# EAGLE design LT5560 (EAGLE 9.3.1)
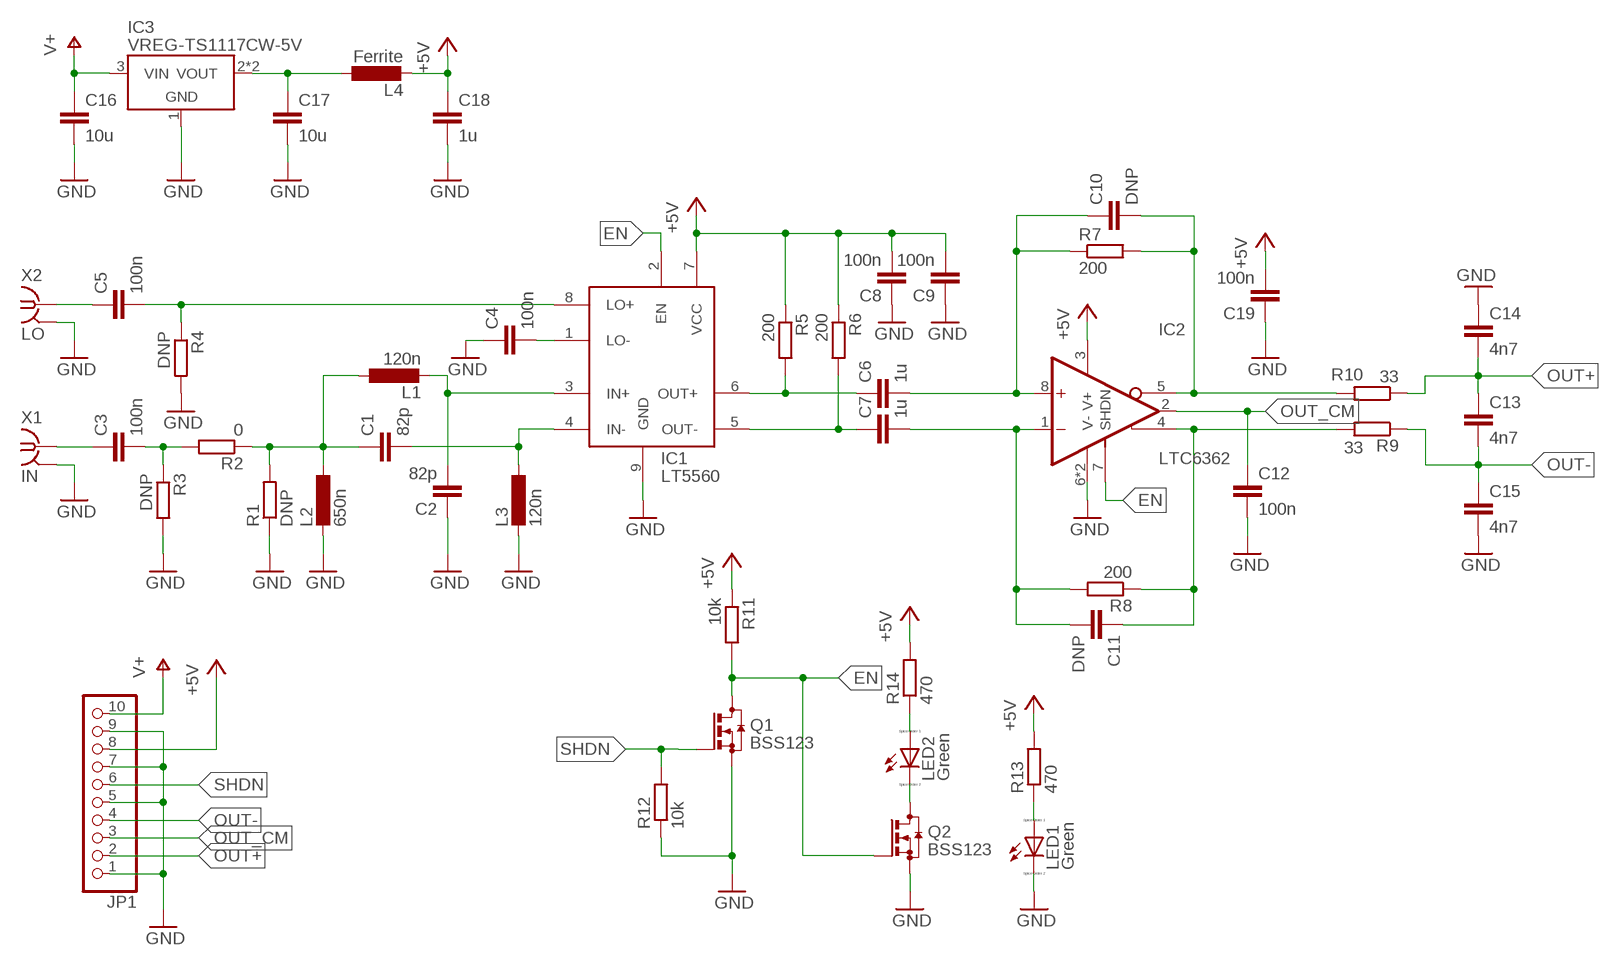
[diagram p0: schematic, sheet 1]

## Parts
C1  82p  C-EUC0603  [C0603]
C2  82p  C-EUC0603  [C0603]
C3  100n  C-EUC0603  [C0603]
C4  100n  C-EUC0603  [C0603]
C5  100n  C-EUC0603  [C0603]
C6  1u  C-EUC0603  [C0603]
C7  1u  C-EUC0603  [C0603]
C8  100n  C-EUC0603  [C0603]
C9  100n  C-EUC0603  [C0603]
C10  DNP  C-EUC0603  [C0603]
C11  DNP  C-EUC0603  [C0603]
C12  100n  C-EUC0603  [C0603]
C13  4n7  C-EUC0603  [C0603]
C14  4n7  C-EUC0603  [C0603]
C15  4n7  C-EUC0603  [C0603]
C16  10u  C-EUC1206  [C1206]
C17  10u  C-EUC1206  [C1206]
C18  1u  C-EUC0603  [C0603]
C19  100n  C-EUC0603  [C0603]
IC1  LT5560  [SON50P300X300X80-9T165X238]
IC2  LTC6362  [SON50P300X300X80-9T165X238]
IC3  VREG-TS1117CW-5V  [SOT223]
JP1  PINHD-1X10/90  [1X10/90]
L1  120n  INDUCTOR0603  [R0603]
L2  650n  INDUCTOR0603  [R0603]
L3  120n  INDUCTOR0603  [R0603]
L4  Ferrite  INDUCTOR0603  [R0603]
LED1  Green  LED_ESML0603  [LED_SML0603]
LED2  Green  LED_ESML0603  [LED_SML0603]
Q1  BSS123  [SOT23]
Q2  BSS123  [SOT23]
R1  DNP  R-EU_R0603  [R0603]
R2  0  R-EU_R0603  [R0603]
R3  DNP  R-EU_R0603  [R0603]
R4  DNP  R-EU_R0603  [R0603]
R5  200  R-EU_R0603  [R0603]
R6  200  R-EU_R0603  [R0603]
R7  200  R-EU_R0603  [R0603]
R8  200  R-EU_R0603  [R0603]
R9  33  R-EU_R0603  [R0603]
R10  33  R-EU_R0603  [R0603]
R11  10k  R-EU_R0603  [R0603]
R12  10k  R-EU_R0603  [R0603]
R13  470  R-EU_R0603  [R0603]
R14  470  R-EU_R0603  [R0603]
X1  IN  SMA_CONNECTOR  [J502-ND-142-0711-821/826]
X2  LO  SMA_CONNECTOR  [J502-ND-142-0711-821/826]

## Nets
+5V: C8.2 C9.2 C18.1 C19.2 IC1.7(VCC) IC2.3(V+) JP1.8 L4.2 R5.1 R6.1 R11.1 R13.2 R14.2
EN: IC1.2(EN) IC2.7(SHDN) Q1.3(D) Q2.1(G) R11.2
GND: C2.1 C4.1 C8.1 C9.1 C12.2 C14.1 C15.2 C16.2 C17.2 C18.2 C19.1 IC1.9(GND) IC2.6(V-) IC2.9(V-) IC3.1(GND) JP1.1 JP1.5 JP1.7 JP1.9 L2.2 L3.2 LED1.C Q1.2(S) Q2.2(S) R1.1 R3.2 R4.2 R12.1 X1.G@1 X1.G@2 X1.G@3 X1.G@4 X2.G@1 X2.G@2 X2.G@3 X2.G@4
GND1: LED2.C Q2.3(D)
N$1: C1.2 IC1.4(IN-) L3.1
N$2: C2.2 IC1.3(IN+) L1.2
N$3: C1.1 L1.1 L2.1 R1.2 R2.1
N$4: C3.1 X1.1
N$5: C3.2 R2.2 R3.1
N$6: C4.2 IC1.1(LO-)
N$7: C5.2 IC1.8(LO+) R4.1
N$8: C5.1 X2.1
N$9: C11.1 IC2.4(+OUT) R8.1 R9.2
N$10: C6.1 IC1.6(OUT+) R5.2
N$11: C7.1 IC1.5(OUT-) R6.2
N$12: C6.2 C10.1 IC2.8(+IN) R7.1
N$13: C7.2 C11.2 IC2.1(-IN) R8.2
N$14: C10.2 IC2.5(-OUT) R7.2 R10.2
N$20: C17.1 IC3.2(VOUT) IC3.4(VOUT) L4.1
N$21: LED2.A R14.1
N$22: LED1.A R13.1
OUT+: C13.1 C14.2 JP1.2 R10.1
OUT-: C13.2 C15.1 JP1.4 R9.1
OUT_CM: C12.1 IC2.2(VOCM) JP1.3
SHDN: JP1.6 Q1.1(G) R12.2
V+: C16.1 IC3.3(VIN) JP1.10

## Library data of the parts
C1-C15 C19 = resistor:C-EU: CAPACITOR, European symbol
C16-C18 = rcl:C-EU: CAPACITOR, European symbol
IC1 = rf:LT5560
IC2 = rf:LTC6362
IC3 = we-power:VREG: Voltage Regulators (LDOs, Switching Converters...) LDOs Taiwan Semi TS1117 800mA max 15V - compatible On Semi NCP1117 1A max 20V - compatible Diodes AP2111H 0.6A max 6V (0.25V@0.6A) - compatible Diodes AP2114H 1A max 6V (0.45V@1A) Taiwan Semi TS9011 250mA max 12V - compatible Diodes AP2210 300mA max 15V - compatible Microchip MCP1700 250mA max 6.5V - compatible Microchip MCP1702 250mA max 13V - compatible Microchip MCP1703 250mA max 16V - compatible Microchip MCP1754 150mA max 16V Taiwan Semi TS5204 150mA max 16V (low noise) DC/DC Converter Modules Recom R-78Ex.x-1.0-W36 1A max 28V - compatible CUI V78xx-2000 2A max 18V Murata OKI-78SR-x.x/1.5-W36 1.5A max 36V
JP1 = pinhead:PINHD-1X10: PIN HEADER
L1-L4 = rf:INDUCTOR
LED1 LED2 = eagle-ltspice:LED_E: LED Source: http://www.osram.convergy.de Source: www.luxeon.com Source: www.kingbright.com; SPICEMODEL: NONE; SPICEPREFIX: D; SPICETYPE: diode
Q1 Q2 = transistor-small-signal:BSS123: N-CHANNEL MOS FET
R1-R12 = rcl:R-EU_: RESISTOR, European symbol
R13 R14 = resistor:R-EU_: RESISTOR, European symbol
X1 X2 = rf:SMA_CONNECTOR

## Board
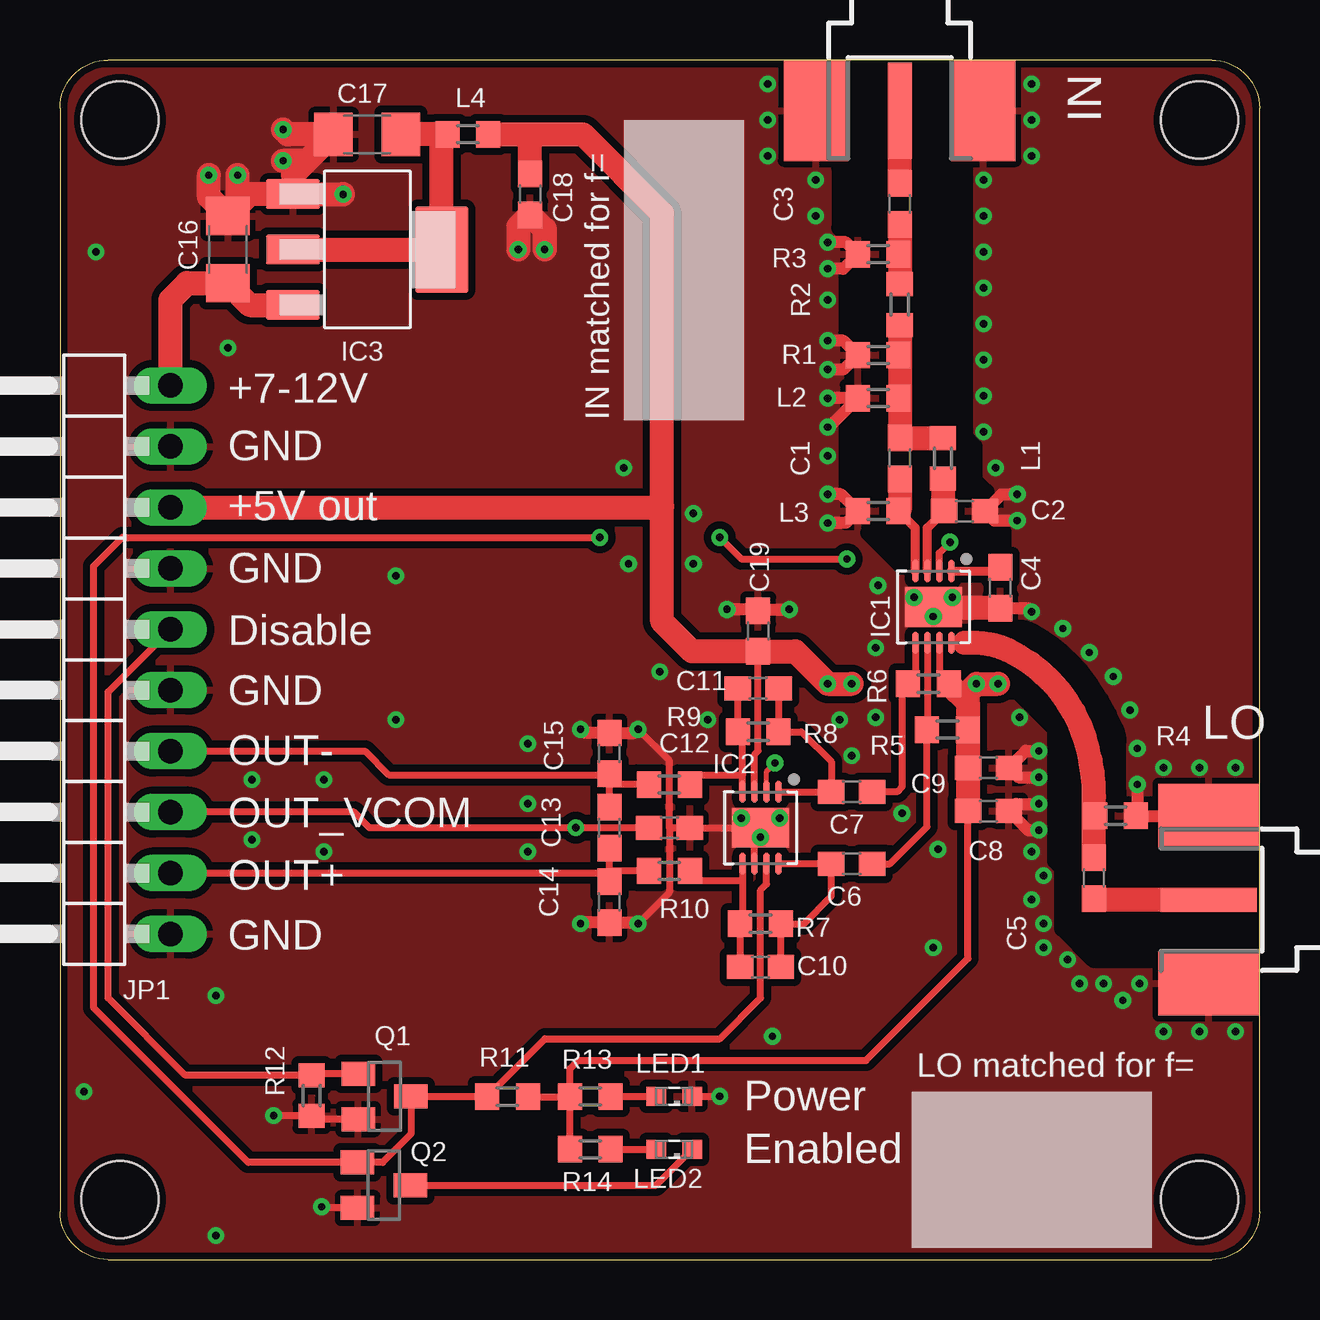
[diagram p1: board, top side]
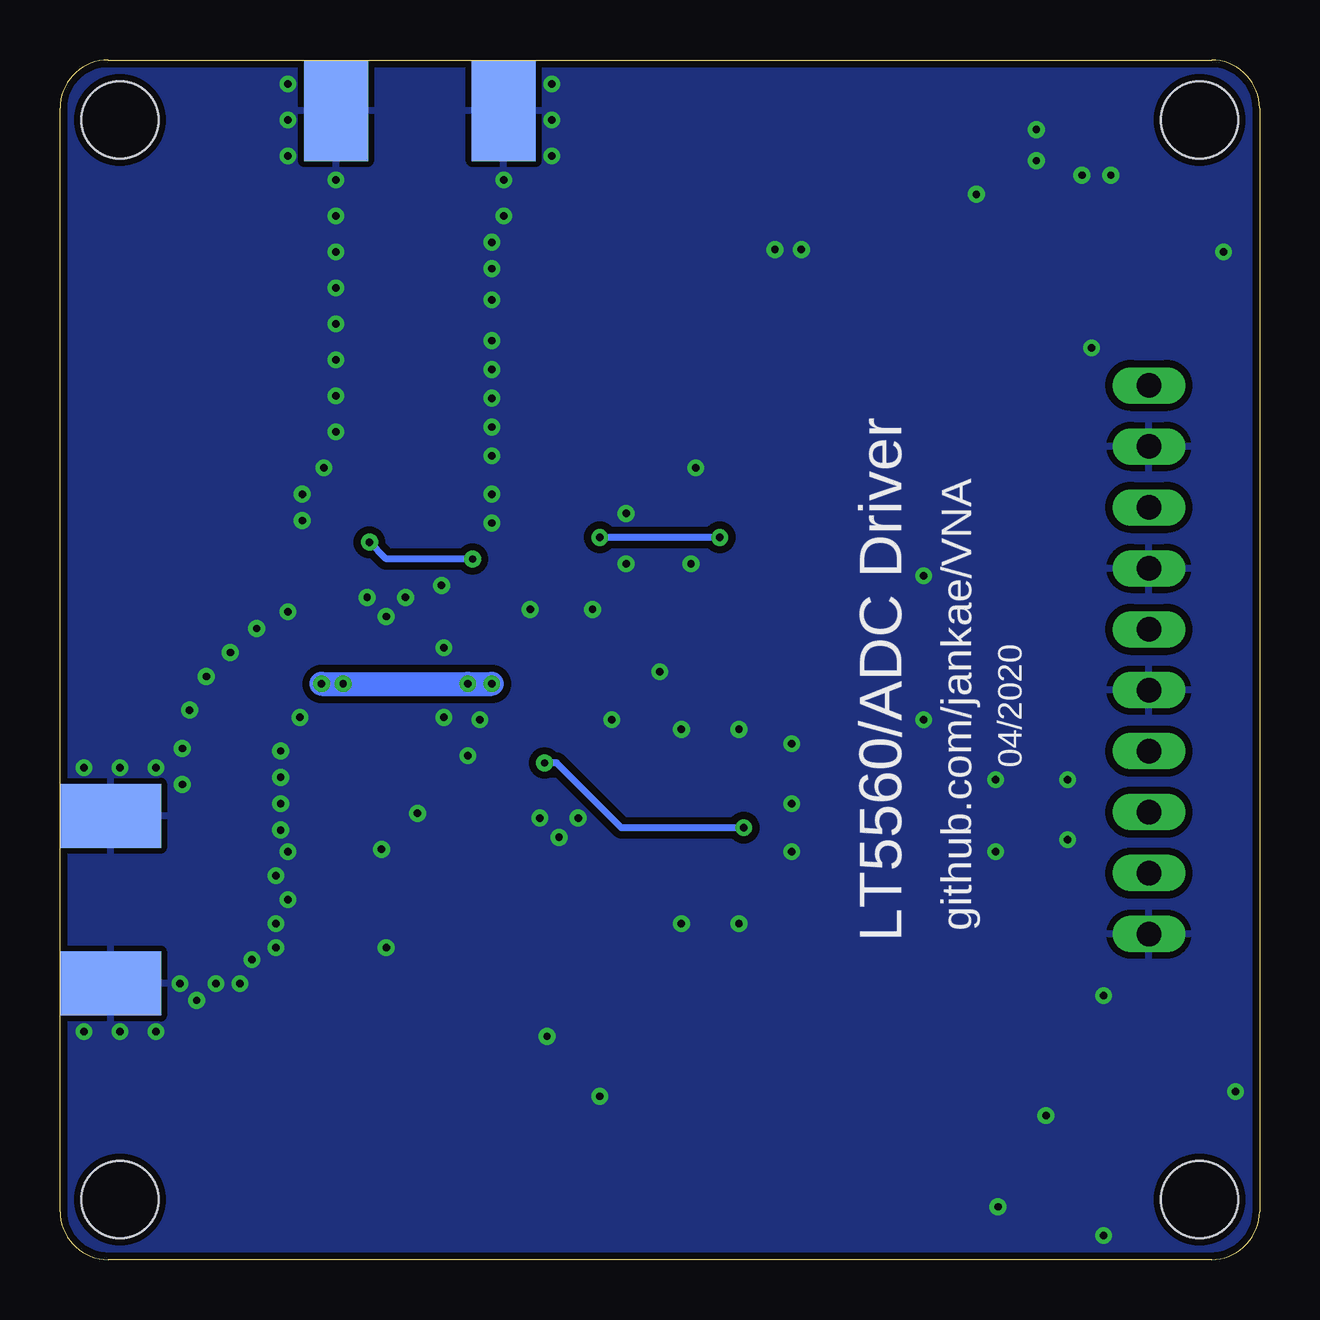
[diagram p2: board, bottom side, seen from below]

Size 50 x 50 mm. Coordinates in mm from the lower left corner, seen from the top.
Outline: 0,48 0,2 arc90 2,0 48,0 arc90 50,2 50,48 arc90 48,50 2,50 arc90 0,48
Copper layers (1*16): Top 0.035mm / dielectric 0.2mm / Bottom 0.035mm
Design rules "JLCPCB4L_7628 *": minimum track width 6mil, minimum drill 0.3mm, track to track 3.5mil, track to pad 3.5mil, pad to pad 3.5mil, via to via 3.5mil, smd to smd 0mil, copper to edge 0.2mm, drill to drill 0.2mm, minimum pad ring 10mil, minimum via ring 8mil, stop-mask expansion 4mil, vias tented up to drill 0mil, thermal gap 10mil
Holes 3.2 mm at 2.5,47.5 47.5,47.5 47.5,2.5 2.5,2.5
tRestrict: 38 lines

### Footprints (pad centres in the part's own frame; a part is rotated, then mirrored left to right if it is on the bottom)
C0603 = smd 1.1 x 1: 1 -0.85,0; 2 0.85,0
C1206 = smd 1.6 x 1.8: 1 -1.4,0; 2 1.4,0
SON50P300X300X80-9T165X238 = smd 0.917 x 0.27: 1 -1.497,0.75; 2 -1.497,0.25; 3 -1.497,-0.25; 4 -1.497,-0.75; 5 1.497,-0.75; 6 1.497,-0.25; 7 1.497,0.25; 8 1.497,0.75 | smd 1.65 x 2.38: 9 0,0
SOT223 = smd 2.235 x 1.219: 1 -3.099,2.311; 2 -3.099,0; 3 -3.099,-2.311 | smd 2.2 x 3.6: 4 3.099,0
1X10/90 = drill 1.016 long: 1 -11.43,-3.81; 2 -8.89,-3.81; 3 -6.35,-3.81; 4 -3.81,-3.81; 5 -1.27,-3.81; 6 1.27,-3.81; 7 3.81,-3.81; 8 6.35,-3.81; 9 8.89,-3.81; 10 11.43,-3.81
R0603 = smd 1 x 1.1: 1 -0.85,0; 2 0.85,0
LED_SML0603 = smd 0.8 x 0.8: A 0.75,0; C -0.75,0
SOT23 = smd 1 x 1.4: 1 -0.95,-1.1; 2 0.95,-1.1; 3 0,1.1
J502-ND-142-0711-821/826 = smd 4 x 1: 1 2.115,0 | smd 4.191 x 2.667: G@1 2.115,3.495; G@2 2.115,-3.495 | smd 4.191 x 2.667 bottom: G@3 2.115,3.495; G@4 2.115,-3.495

### Placement (x,y rotation side)
C1  35,33.4 270 top
C2  37.7,31.2 180 top
C3  35,44 270 top
C4  39.2,28 90 top
C5  43.1,15.9 90 top
C6  33,16.5 180 top
C7  33,19.5 180 top
C8  38.7,18.7 180 top
C9  38.7,20.5 180 top
C10  29.2,12.2 180 top
C11  29.1,23.8 0 top
C12  25.4,18 0 top
C13  22.9,18 90 top
C14  22.9,14.9 90 top
C15  22.9,21.1 90 top
C16  7,42.1 90 top
C17  12.8,46.9 180 top
C18  19.6,44.4 270 top
C19  29.1,26.2 270 top
IC1  36.4,27.2 270 top
IC2  29.2,18 270 top
IC3  12.81,42.1 0 top
JP1  0.8,25 90 top
L1  36.8,33.4 270 top
L2  34.1,35.9 180 top
L3  34.1,31.2 180 top
L4  17,46.9 0 top
LED1  25.6,6.8 180 top
LED2  25.6,4.6 180 top
Q1  13.53,6.8 270 top
Q2  13.5,3.1 270 top
R1  34.1,37.7 0 top
R2  35,39.8 90 top
R3  34.1,41.9 180 top
R4  44,18.5 0 top
R5  36.99,22.09 180 top
R6  36.2,24 180 top
R7  29.2,14 180 top
R8  29.1,22 0 top
R9  25.4,19.8 0 top
R10  25.4,16.2 0 top
R11  18.65,6.79 180 top
R12  10.49,6.83 90 top
R13  22.1,6.8 180 top
R14  22.1,4.6 180 top
X1  35,50 270 top
X2  50,15 180 top

### Tracks (layer width: path | path; a pad name or v marks a point on that pad's centre or on a via)
+5V  (via drill 0.3)
  Top 0.3: IC2.3 28.95,21.05 29.1,21.2 C19.2 | IC1.7 36.65,24.4 R6.1 | R11.1 R13.2 | R13.2 21.25,7.95 21.6,8.3 33.6,8.3 37.85,12.55 C8.2 | R14.2 21.25,6.78 R13.2
  Top 1: R6.1 37.84,23.21 | 37.84,23.21 R5.1 C9.2 C8.2 | L4.2 19.6,46.9 | C18.1 19.6,46.9 | 19.6,46.9 20.7,46.9 21.8,46.9 25.1,43.6 25.1,31.4 | 37.84,23.21 37.84,23.64 v38.2,24 v39.1,24 | v33,24 v32,24 30.65,25.35 C19.2 26.35,25.35 25.1,26.6 25.1,31.4 | JP1.8 25.05,31.35 25.1,31.4
  Bottom 1: v39.1,24 v33,24 v32,24
EN  (via drill 0.3)
  Top 0.3: IC2.7 29.45,15.65 29.2,15.4 29.2,10.9 27.5,9.2 20.21,9.2 R11.2 Q1.3 14.63,5.23 13.45,4.05 Q2.1 7.85,4.05 1.4,10.5 1.4,28.9 2.6,30.1 v22.5,30.1 | IC1.2 36.65,29.45 v37.1,29.9 | v27.5,30.1 28.4,29.2 v32.8,29.2
  Bottom 0.3: v22.5,30.1 v27.5,30.1 | v32.8,29.2 36.4,29.2 v37.1,29.9
GND  (via drill 0.3)
  Top 0.3: IC2.6 28.95,17.75 29.05,17.85 | 29.05,17.85 IC2.9 | 29.05,17.85 28.9,18 C12.2 25.4,18 | Q1.2 10.62,5.85 R12.1 8.92,5.98 v8.9,6 | Q2.2 10.95,2.15 v10.9,2.2 | LED1.C v27.5,6.8 | 25.4,18 25.4,20.8 v24.1,22.1 | 25.4,18 25.4,15.3 v24.1,14
  Top 0.5: v32,42.4 32.75,42.4 R3.2 32.65,41.3 v32,41.3 | v32,38.3 32.65,38.3 R1.1 32.65,37.1 v32,37.1 | v32,35.9 L2.2 32.05,34.7 v32,34.7 | v32,31.9 32.55,31.9 L3.2 32.75,30.7 v32,30.7 | v30.4,27.1 29.15,27.1 C19.1 29.05,27.1 v27.8,27.1 | v39.9,30.8 38.95,30.8 C2.1 39.25,31.9 v39.9,31.9 | C4.1 40.35,27.15 v40.5,27 | v24.1,22.1 23.95,21.95 C15.2 21.85,21.95 v21.7,22.1 | v24.1,14 24.05,14.05 C14.1 21.75,14.05 v21.7,14 | v40.8,17.9 40.35,17.9 C8.1 39.85,19 v40.8,19 | v40.8,20.1 39.95,20.1 C9.1 40.25,21.2 v40.8,21.2 | X2.G@4 R4.2 44.9,18.55 v44.9,19.8
  Top 1: C4.1 36.45,27.15 IC1.9 | IC3.1 7.91,44.41 C16.2 | IC3.1 11.79,44.41 v11.8,44.4 | C17.2 9.5,46.9 v9.3,47.1 | C17.2 10.3,45.8 v9.3,45.8 | C17.2 9.71,45.21 IC3.1 | C16.2 6.2,44.3 v6.2,45.2 | C16.2 7.4,43.9 v7.4,45.2 | v19.1,42.1 19.1,43.05 C18.2 20.2,42.95 v20.2,42.1
  other vias: 36.4,26.8 37.2,27.6 35.6,27.6 30,18.4 28.4,18.4 29.2,17.6 34,22.6 34,25.5 34.1,28.1 26.4,29 26.4,31.1 23.7,29 35.1,18.6 36.6,17.1 36.4,13 29.7,9.3 49,9.5 47.5,9.5 46,9.5 45,11.5 49,20.5 47.5,20.5 46,20.5 43.5,11.5 42,12.5 41,14 41,16 40.5,17 40.5,15 41,13 42.5,11.5 44.3,10.8 44.9,21.3 44.6,22.9 43.9,24.3 42.9,25.3 41.8,26.3 40,22.6 40.5,49 40.5,47.5 40.5,46 38.5,45 29.5,49 29.5,47.5 29.5,46 31.5,45 31.5,43.5 38.5,43.5 38.5,42 38.5,40.5 38.5,39 38.5,37.5 38.5,36 38.5,34.5 39,33 32,40 32,33.5 6.5,1 1,7 6.5,11 19.5,17 11,17 19.5,19 8,20 11,20 8,17.5 19.5,21.5 14,22.5 14,28.5 23.5,33 7,38 1.5,42 32.5,22.5 33,21 27,22.5 25,24.5
  pour Bottom (isolate 0.3): -2,52.2 53.9,52.2 53.9,-2.7 -2,-2.7
  pour Top (isolate 0.3): -2.1,52.4 53.6,52.4 53.6,-1.9 -2.1,-1.9
GND1
  Top 0.3: Q2.3 24.85,3.1 LED2.C
N$1
  Top 0.37: IC1.4 35.65,30.5 L3.1 | 34.95,32.5 C1.2
  Top 1: C1.2 35,31.25 L3.1
N$2
  Top 0.37: IC1.3 36.15,30.5 C2.2 | 36.85,32.5 L1.2
  Top 1: L1.2 36.8,31.25 C2.2
N$3
  Top 0.37: R1.2 35,37.7 | L2.1 35,35.9
  Top 1: R2.1 35,37.5 | 35,37.5 35,36 | 35,36 C1.1 L1.1 | L2.1 34.95,35.95 35,36 | R1.2 34.95,37.55 35,37.5
N$4
  Top 1: C3.1 X1.1
N$5
  Top 0.37: R3.1 35,41.9
  Top 1: C3.2 35,42 | 35,42 R2.2 | R3.1 34.95,41.95 35,42
N$6
  Top 0.37: IC1.1 39.05,28.7 C4.2
N$7
  Top 0.305: 37.7,25.7 arc-3 IC1.8
  Top 0.37: 43.1,18.45 R4.1
  Top 1: 43.1,18.45 C5.2 43.1,19.3 arc18 42.7,21.8 arc47 39.5,25.4 arc24 38.2,25.7 arc2 37.7,25.7
N$8
  Top 0.37: 43.15,15 C5.1
  Top 1: X2.1 43.15,15
N$9
  Top 0.3: IC2.4 28.45,20.2 | 28.45,20.2 28.45,20.3 28.45,21.8 R8.1 C11.1 | R9.2 26.65,20.2 28.45,20.2
N$10
  Top 0.2: R5.2
  Top 0.3: IC1.6 R5.2 36.14,18.04 34.6,16.5 C6.1
N$11
  Top 0.2: 35.65,24.3 R6.2
  Top 0.3: IC1.5 35.65,24.3 R6.2 35.1,23.75 35.1,19.7 34.9,19.5 C7.1
N$12
  Top 0.3: C10.1 R7.1 31,14 32.15,15.15 C6.2 IC2.8
N$13
  Top 0.3: IC2.1 32.1,19.5 C7.2 | C7.2 | C11.2 R8.2 30.9,22 32.15,20.75 C7.2
N$14
  Top 0.3: IC2.5 28.45,15.9 28.45,15.8 | 28.45,15.8 28.45,14.1 R7.2 C10.2 | R10.2 26.65,15.8 28.45,15.8
N$20
  Top 1: IC3.2 IC3.4 15.91,46.66 L4.1 C17.1
N$21
  Top 0.3: R14.1 LED2.A
N$22
  Top 0.3: R13.1 LED1.A
OUT+
  Top 0.3: C14.2 22.9,16 | 22.9,16 22.9,16.2 | 22.9,16.2 C13.1 | JP1.2 22.79,16.11 22.9,16 | R10.1 22.9,16.2
OUT-
  Top 0.3: C13.2 22.9,19.8 | 22.9,19.8 C15.1 22.85,20.2 13.7,20.2 12.71,21.19 JP1.4 | R9.1 22.9,19.8
OUT_CM  (via drill 0.3)
  Top 0.2: IC2.2 29.45,20.35 v29.8,20.7
  Top 0.3: C12.1 v21.5,18 12.9,18 12.25,18.65 JP1.3
  Bottom 0.3: v21.5,18 26.6,18 29.3,20.7 v29.8,20.7
SHDN
  Top 0.3: Q1.1 10.56,7.75 R12.2 5.22,7.68 2,10.9 2,23.66 JP1.6
V+
  Top 1: JP1.10 4.61,40.01 5.3,40.7 C16.1 7.91,39.79 IC3.3

### Text on the board
tPlace: IN | +7-12V | IN matched for f= | GND | +5V out | GND | Disable | GND | LO | OUT- | OUT_VCOM | OUT+ | GND | LO matched for f= | Power | Enabled
bPlace: LT5560/ADC Driver | 04/2020 | github.com/jankae/VNA